# Altium schematic sheet Power.SchDoc
size A4
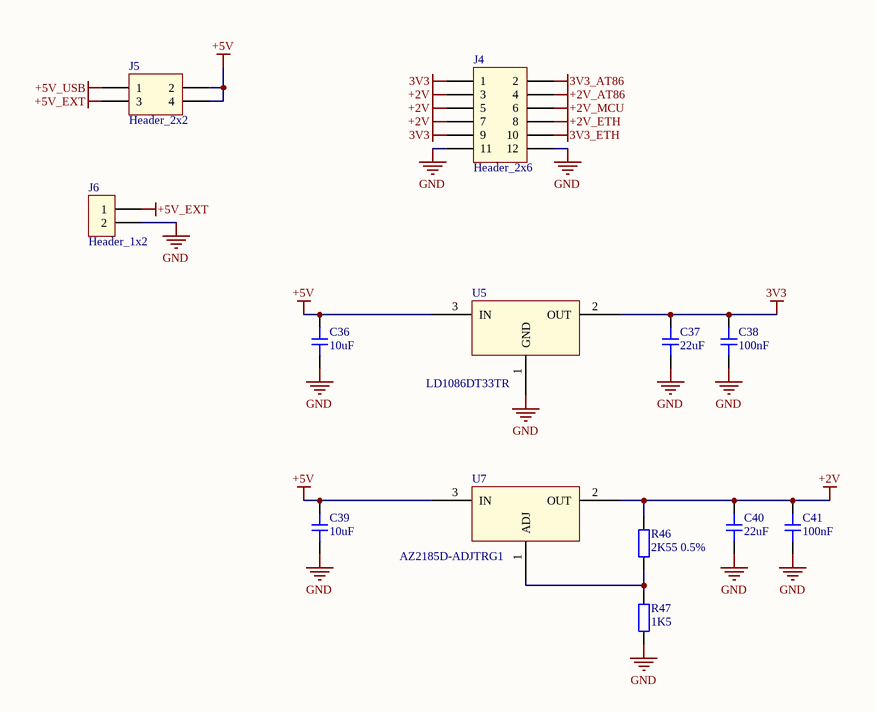
[diagram p0: Power.SchDoc]

## Parts
C36  value 10uF  [Capacitor-1210]  (hidden comment: C-10uF-1210)
C37  value 22uF  [Capacitor-1210]  (hidden comment: C-22uF-1210)
C38  value 100nF  [Capacitor-0603]  (hidden comment: C-100nF-0603)
C39  value 10uF  [Capacitor-1210]  (hidden comment: C-10uF-1210)
C40  value 22uF  [Capacitor-1210]  (hidden comment: C-22uF-1210)
C41  value 100nF  [Capacitor-0603]  (hidden comment: C-100nF-0603)
J4  Header_2x6  [Header_2x6]
J5  Header_2x2  [Header_2x2]
J6  Header_1x2  [Header_1x2]
R46  value 2K55 0.5%  [Resistor-0603]  (hidden comment: R-2K55-0603)
R47  value 1K5  [Resistor-0603]  (hidden comment: R-1K5-0603)
U5  LD1086DT33TR  [LD1086DT33TR]
U7  AZ2185D-ADJTRG1  [AZ2185D-ADJTRG1]

## Nets
3V3: C37.2 C38.2 J4.1 J4.9 U5.2(OUT)
3V3_AT86: J4.2
3V3_ETH: J4.10
+2V: C40.2 C41.2 J4.3 J4.5 J4.7 R46.2 U7.2(OUT)
+2V_AT86: J4.4
+2V_ETH: J4.8
+2V_MCU: J4.6
+5V: C36.2 C39.2 J5.2 J5.4 U5.3(IN) U7.3(IN)
+5V_EXT: J5.3 J6.1
+5V_USB: J5.1
GND: C36.1 C37.1 C38.1 C39.1 C40.1 C41.1 J4.11 J4.12 J6.2 R47.1 U5.1(GND)
NetR46_1: R46.1 R47.2 U7.1(ADJ)

## Library data of the parts
C36 C39 = C-10uF-1210: Supplier 1: Digi-Key; Supplier Part Number 1: 399-8225-1-ND
C37 C40 = C-22uF-1210: Supplier 1: Digi-Key; Supplier Part Number 1: 1276-3372-1-ND
C38 C41 = C-100nF-0603: Supplier 1: Digi-Key; Supplier Part Number 1: 1276-1006-1-ND
J4 = Header_2x6: Supplier 1: Digi-Key; Supplier Part Number 1: 2057-PH2-12-UA-ND
J5 = Header_2x2: Supplier 1: Digi-Key; Supplier Part Number 1: 2057-PH2-04-UA-ND
J6 = Header_1x2: Supplier 1: Digi-Key; Supplier Part Number 1: A19423-ND
R46 = R-2K55-0603: Supplier 1: Digi-Key; Supplier Part Number 1: 408-1735-1-ND
R47 = R-1K5-0603: Supplier 1: Digi-Key; Supplier Part Number 1: 311-1.50KHRCT-ND
U5 = LD1086DT33TR: Supplier 1: Digi-Key; Supplier Part Number 1: AZ1117IH-3.3TRG1DICT-ND
U7 = AZ2185D-ADJTRG1: Supplier 1: Digi-Key; Supplier Part Number 1: AZ2185D-ADJTRG1DICT-ND